# Altium schematic sheet apresentação1.SchDoc: apresentação1
size 282 x 200 mm; Date: 02/11/2018 15:39:22; SheetNumber: 1
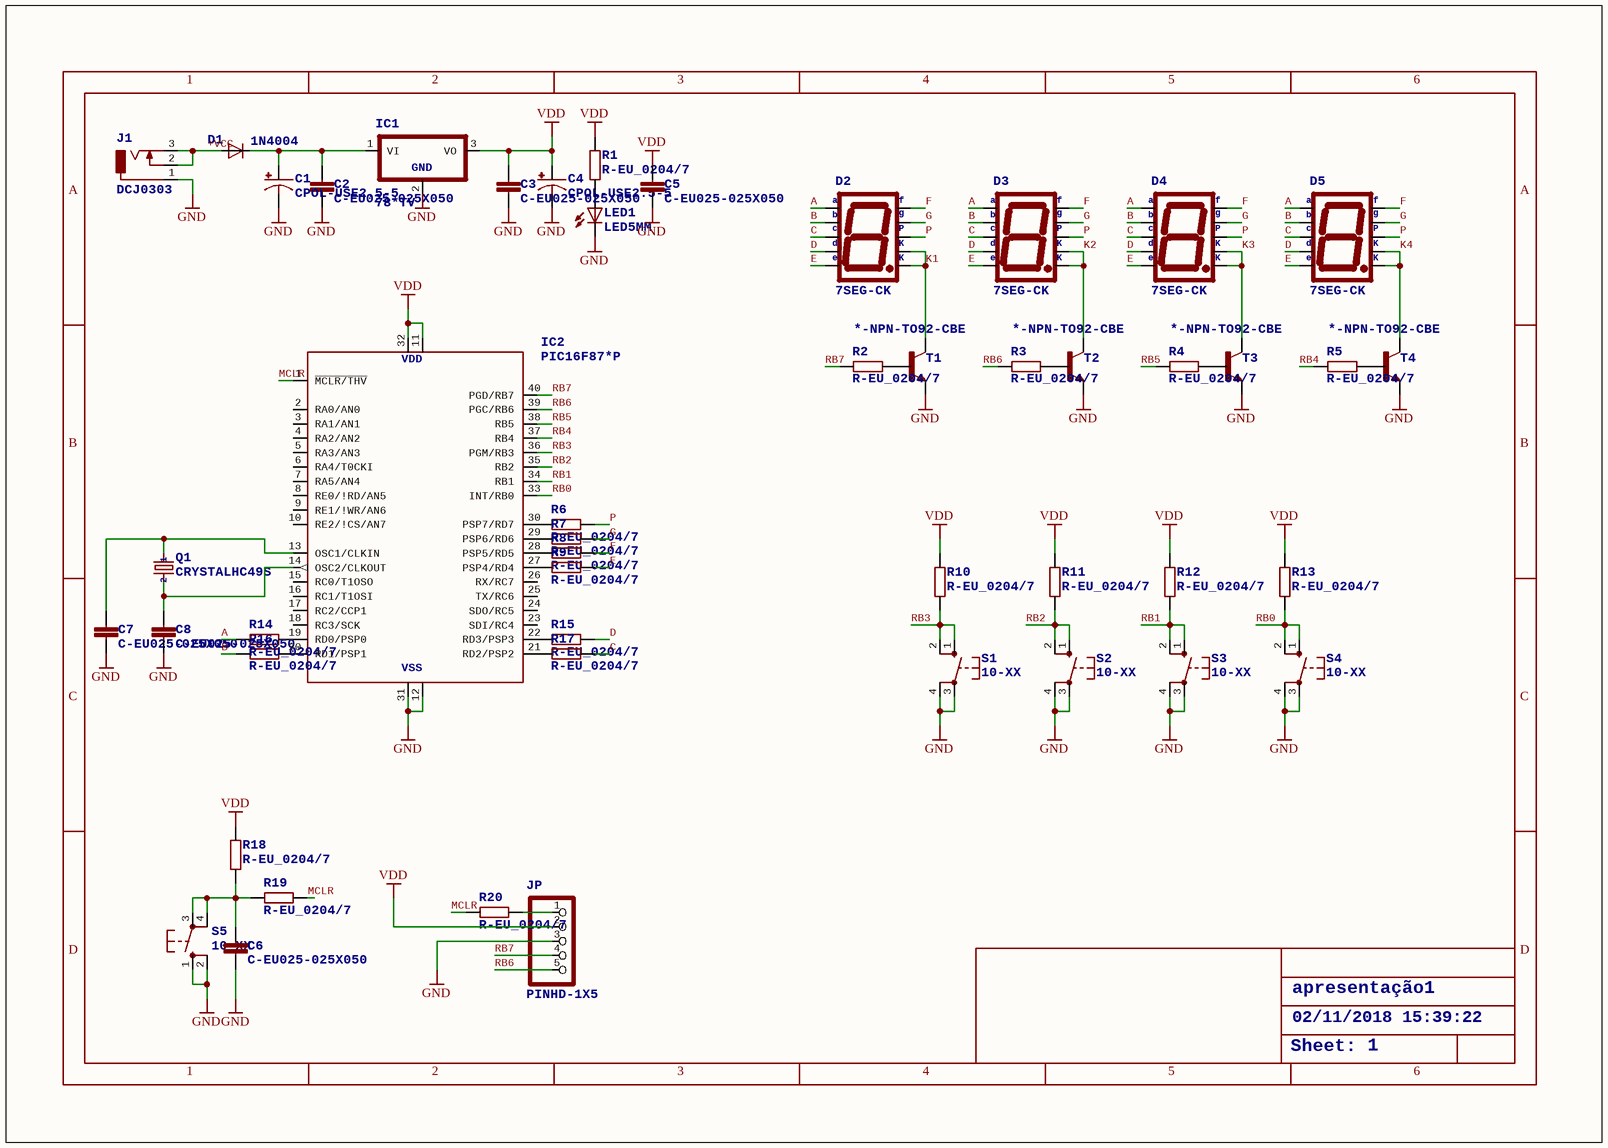
[diagram p0: apresentação1.SchDoc]

## Parts
C1  CPOL-USE2.5-5  [E2,5-5]
C2  C-EU025-025X050  [C025-025X050]
C3  C-EU025-025X050  [C025-025X050]
C4  CPOL-USE2.5-5  [E2,5-5]
C5  C-EU025-025X050  [C025-025X050]
C6  C-EU025-025X050  [C025-025X050]
C7  C-EU025-025X050  [C025-025X050]
C8  C-EU025-025X050  [C025-025X050]
D1  1N4004  [DO41-10]
D2  7SEG-CK  [7SEG-13]
D3  7SEG-CK  [7SEG-13]
D4  7SEG-CK  [7SEG-13]
D5  7SEG-CK  [7SEG-13]
IC1  78*TV  [TO220V]
IC2  PIC16F87*P  [DIL40]
J1  DCJ0303  [DCJ0303]
JP  PINHD-1X5  [1X05]
LED1  LED5MM  [LED5MM]
Q1  CRYSTALHC49S  [HC49/S]
R1  R-EU_0204/7  [0204/7]
R2  R-EU_0204/7  [0204/7]
R3  R-EU_0204/7  [0204/7]
R4  R-EU_0204/7  [0204/7]
R5  R-EU_0204/7  [0204/7]
R6  R-EU_0204/7  [0204/7]
R7  R-EU_0204/7  [0204/7]
R8  R-EU_0204/7  [0204/7]
R9  R-EU_0204/7  [0204/7]
R10  R-EU_0204/7  [0204/7]
R11  R-EU_0204/7  [0204/7]
R12  R-EU_0204/7  [0204/7]
R13  R-EU_0204/7  [0204/7]
R14  R-EU_0204/7  [0204/7]
R15  R-EU_0204/7  [0204/7]
R16  R-EU_0204/7  [0204/7]
R17  R-EU_0204/7  [0204/7]
R18  R-EU_0204/7  [0204/7]
R19  R-EU_0204/7  [0204/7]
R20  R-EU_0204/7  [0204/7]
S1  10-XX  [B3F-10XX]
S2  10-XX  [B3F-10XX]
S3  10-XX  [B3F-10XX]
S4  10-XX  [B3F-10XX]
S5  10-XX  [B3F-10XX]
T1  *-NPN-TO92-CBE  [TO92-CBE]
T2  *-NPN-TO92-CBE  [TO92-CBE]
T3  *-NPN-TO92-CBE  [TO92-CBE]
T4  *-NPN-TO92-CBE  [TO92-CBE]

## Nets
GND: C1.- C2.2 C3.2 C4.- C5.2 C6.2 C7.2 C8.2 IC1.2(GND) IC2.12(VSS) IC2.31(VSS) J1.1 JP.3 LED1.K(C) S1.3(P) S1.4(P1) S2.3(P) S2.4(P1) S3.3(P) S3.4(P1) S4.3(P) S4.4(P1) S5.1(S) S5.2(S1) T1.E T2.E T3.E T4.E
VDD: C3.1 C4.+ C5.1 IC1.3(VO) IC2.11(VDD) IC2.32(VDD) JP.2 R1.1 R10.2 R11.2 R12.2 R13.2 R18.2
+VCC: D1.A J1.2 J1.3
A: D2.7(A) D3.7(A) D4.7(A) D5.7(A) R14.1
B: D2.6(B) D3.6(B) D4.6(B) D5.6(B) R16.1
C: D2.4(C) D3.4(C) D4.4(C) D5.4(C) R17.2
D: D2.2(D) D3.2(D) D4.2(D) D5.2(D) R15.2
E: D2.1(E) D3.1(E) D4.1(E) D5.1(E) R9.2
F: D2.9(F) D3.9(F) D4.9(F) D5.9(F) R8.2
G: D2.10(G) D3.10(G) D4.10(G) D5.10(G) R7.2
K1: D2.3(CK1) D2.8(CK2) T1.C
K2: D3.3(CK1) D3.8(CK2) T2.C
K3: D4.3(CK1) D4.8(CK2) T3.C
K4: D5.3(CK1) D5.8(CK2) T4.C
MCLR: IC2.1(~{MCLR/THV}) R19.1 R20.2
P: D2.5(DP) D3.5(DP) D4.5(DP) D5.5(DP) R6.2
RB0: IC2.33(INT/RB0) R13.1 S4.1(S) S4.2(S1)
RB1: IC2.34(RB1) R12.1 S3.1(S) S3.2(S1)
RB2: IC2.35(RB2) R11.1 S2.1(S) S2.2(S1)
RB3: IC2.36(PGM/RB3) R10.1 S1.1(S) S1.2(S1)
RB4: IC2.37(RB4) R5.1
RB5: IC2.38(RB5) R4.1
RB6: IC2.39(PGC/RB6) JP.5 R3.1
RB7: IC2.40(PGD/RB7) JP.4 R2.1
NetC1_+: C1.+ C2.1 D1.C IC1.1(VI)
NetC6_1: C6.1 R18.1 R19.2 S5.3(P) S5.4(P1)
NetC7_1: C7.1 IC2.13(OSC1/CLKIN) Q1.1
NetC8_1: C8.1 IC2.14(OSC2/CLKOUT) Q1.2
NetIC2_19: IC2.19(RD0/PSP0) R14.2
NetIC2_20: IC2.20(RD1/PSP1) R16.2
NetIC2_21: IC2.21(RD2/PSP2) R17.1
NetIC2_22: IC2.22(RD3/PSP3) R15.1
NetIC2_27: IC2.27(PSP4/RD4) R9.1
NetIC2_28: IC2.28(PSP5/RD5) R8.1
NetIC2_29: IC2.29(PSP6/RD6) R7.1
NetIC2_30: IC2.30(PSP7/RD7) R6.1
NetJP_1: JP.1 R20.1
NetLED1_A: LED1.A R1.2
NetR2_2: R2.2 T1.B
NetR3_2: R3.2 T2.B
NetR4_2: R4.2 T3.B
NetR5_2: R5.2 T4.B

Not connected (* = marked no-connect by the designer): IC2 2(RA0/AN0) 3(RA1/AN1) 4(RA2/AN2) 5(RA3/AN3) 6(RA4/T0CKI) 7(RA5/AN4) 8(RE0/!RD/AN5) 9(RE1/!WR/AN6) 10(RE2/!CS/AN7) 15(RC0/T1OSO) 16(RC1/T1OSI) 17(RC2/CCP1) 18(RC3/SCK) 23(SDI/RC4) 24(SDO/RC5) 25(TX/RC6) 26(RX/RC7)

## Notes on the sheet
- apresentação1
- 02/11/2018 15:39:22
- Sheet:
- 1
- 2
- 3
- 4
- 5
- 6
- A
- B
- C
- D

## Library data of the parts
C1 C4 = CPOL-USE2.5-5: POLARIZED CAPACITOR, American symbol
C2 C3 C5-C8 = C-EU025-025X050: CAPACITOR, European symbol
D1 = 1N4004: DIODE   general purpose rectifier, 1 A
D2-D5 = 7SEG-CK: 7-segment DISPLAY   single cathode, 13 mm; a: a; b: b; c: c; d: d; e: e; f: f; g: g; P: P; K: K
IC1 = 78*TV: Positive VOLTAGE REGULATOR   Source: http://cache.national.com/ds/LM/LM78L05.pdf http://www.fairchildsemi.com/ds/LM/LM7805.pdf; GND: GND
IC2 = PIC16F87*P: MICROCONTROLLER; MPN: PIC16F874-04I/P; MF: MICROCHIP; OC_FARNELL: 1196797; OC_NEWARK: 24M5903; VDD: VDD; VSS: VSS
J1 = DCJ0303: DC POWER JACK   Source: DCJ0303.pdf; OC_FARNELL: unknown; OC_NEWARK: unknown
JP = PINHD-1X5: PIN HEADER
LED1 = LED5MM: LED   OSRAM: - CHIPLED LG R971, LG N971, LY N971, LG Q971, LY Q971, LO R971, LY R971 LH N974, LH R974 LS Q976, LO Q976, LY Q976 LO Q996 - Hyper CHIPLED LW Q18S LB Q993, LB Q99A, LB R99A - SideLED LS A670, LO A670, LY A670, LG A670, LP A670 LB A673, LV A673, LT A673, LW A673 LH A674 LY A675 LS A676, LA A676, LO A676, LY A676, LW A676 LS A679, LY A679, LG A679 -  Hyper Micro SIDELEDÂ® LS Y876, LA Y876, LO Y876, LY Y876 LT Y87S - SmartLED LW L88C, LW L88S LB L89C, LB L89S, LG L890 LS L89K, LO L89K, LY L89K LS L896, LA L896, LO L896, LY L896 - TOPLED LS T670, LO T670, LY T670, LG T670, LP T670 LSG T670, LSP T670, LSY T670, LOP T670, LYG T670 LG T671, LOG T671, LSG T671 LB T673, LV T673, LT T673, LW T673 LH T674 LS T676, LA T676, LO T676, LY T676, LB T676, LH T676, LSB T676, LW T676 LB T67C, LV T67C, LT T67C, LS T67K, LO T67K, LY T67K, LW E67C LS E67B, LA E67B, LO E67B, LY E67B, LB E67C, LV E67C, LT E67C LW T67C LS T679, LY T679, LG T679 LS T770, LO T770, LY T770, LG T770, LP T770 LB T773, LV T773, LT T773, LW T773 LH T774 LS E675, LA E675, LY E675, LS T675 LS T776, LA T776, LO T776, LY T776, LB T776 LHGB T686 LT T68C, LB T68C - Hyper Mini TOPLEDÂ® LB M676 - Mini TOPLED SantanaÂ® LG M470 LS M47K, LO M47K, LY M47K    Source: http://www.osram.convergy.de   LUXEON: - LUMILEDÂ® LXK2-PW12-R00, LXK2-PW12-S00, LXK2-PW14-U00, LXK2-PW14-V00 LXK2-PM12-R00, LXK2-PM12-S00, LXK2-PM14-U00 LXK2-PE12-Q00, LXK2-PE12-R00, LXK2-PE12-S00, LXK2-PE14-T00, LXK2-PE14-U00 LXK2-PB12-K00, LXK2-PB12-L00, LXK2-PB12-M00, LXK2-PB14-N00, LXK2-PB14-P00, LXK2-PB14-Q00 LXK2-PR12-L00, LXK2-PR12-M00, LXK2-PR14-Q00, LXK2-PR14-R00 LXK2-PD12-Q00, LXK2-PD12-R00, LXK2-PD12-S00 LXK2-PH12-R00, LXK2-PH12-S00 LXK2-PL12-P00, LXK2-PL12-Q00, LXK2-PL12-R00    Source: www.luxeon.com   KINGBRIGHT:   KA-3528ASYC Source: www.kingbright.com
Q1 = CRYSTALHC49S: CRYSTAL; OC_FARNELL: 1667008; OC_NEWARK: unknown; 1: 1; 2: 2
R1-R20 = R-EU_0204/7: RESISTOR, European symbol
S1-S5 = 10-XX: OMRON SWITCH; MPN: B3F-1000; OC_FARNELL: 176432; OC_NEWARK: 36M3542
T1-T4 = *-NPN-TO92-CBE: NPN Transistror   BF959 corrected 2008.03.06